# EAGLE design circuit (EAGLE 6.2)
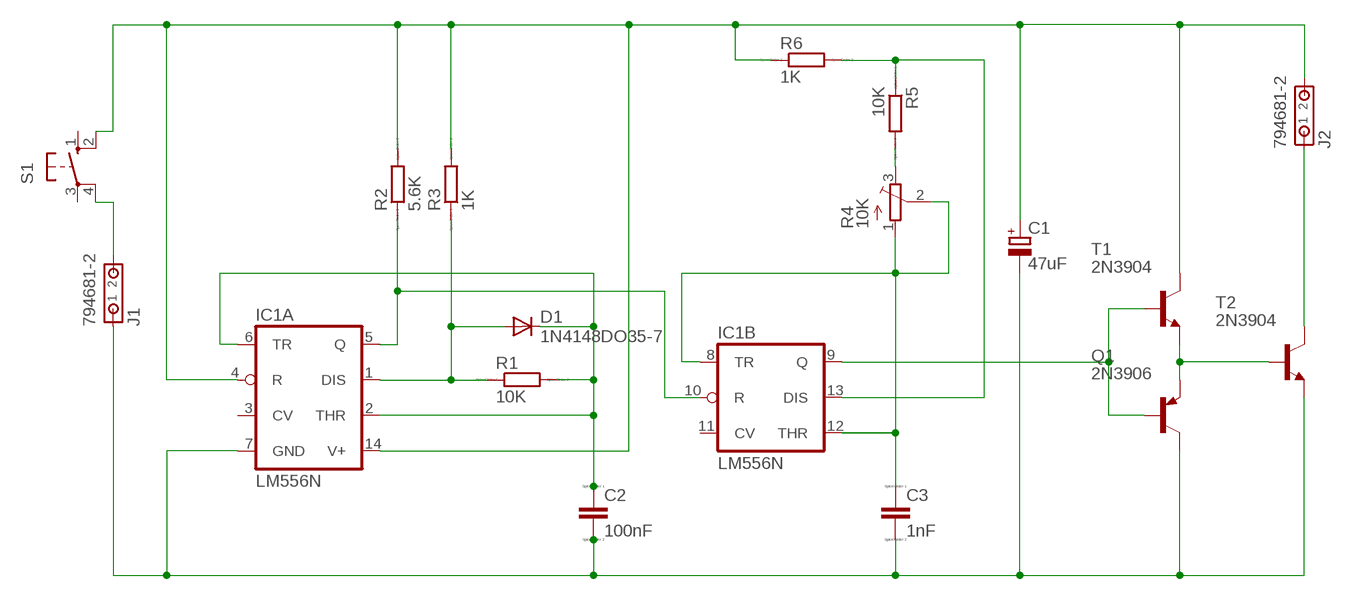
[diagram p0: schematic, sheet 1]

## Parts
C1  47uF  CPOL-EUB45181B  [B45181B]
C2  100nF  C  [C0805]
C3  1nF  C  [C0805]
D1  1N4148DO35-7  [DO35-7]
IC1  LM556N  [DIL14]
J1  794681-2  [794681-2]
J2  794681-2  [794681-2]
Q1  2N3906  [TO92]
R1  10K  R  [R0805]
R2  5.6K  R  [R0805]
R3  1K  R  [R0805]
R4  10K  TRIM_EU-3223J  [3223J]
R5  10K  R  [R0805]
R6  1K  R  [R0805]
S1  10-XX  [B3F-10XX]
T1  2N3904  [TO92]
T2  2N3904  [TO92]

## Nets
N$1: C1.+ IC1.4(A:R) IC1.14(A:V+) J2.2 R2.2 R3.2 R6.1 S1.2(S1) T1.1(C)
N$2: IC1.5(A:Q) IC1.10(B:R) R2.1
N$3: C1.- C2.2 C3.2 IC1.7(A:GND) J1.1 Q1.1(C) T2.3(E)
N$4: C2.1 D1.C IC1.2(A:THR) IC1.6(A:TR) R1.2
N$5: D1.A IC1.1(A:DIS) R1.1 R3.1
N$6: C3.1 IC1.8(B:TR) IC1.12(B:THR) R4.1(A) R4.2(S)
N$7: R4.3(E) R5.2
N$8: IC1.13(B:DIS) R5.1 R6.2
N$10: IC1.9(B:Q) Q1.2(B) T1.2(B)
N$11: Q1.3(E) T1.3(E) T2.2(B)
N$15: J2.1 T2.1(C)
N$20: J1.2 S1.4(P1)
Unconnected: IC1.3(A:CV) IC1.11(B:CV) S1.1(S) S1.3(P)

## Library data of the parts
C1 = rcl:CPOL-EU: POLARIZED CAPACITOR, European symbol
C2 C3 = eagle-ltspice:C: CAPACITOR, European symbol; SPICEMODEL: NONE; SPICEPREFIX: C
D1 = diode:1N4148: DIODE high speed (Philips)
IC1 = linear:*556: Dual TIMER
J1 J2 = con-amp:794681-2: Micro MATE-N-LOK Connectors grid 1.5mm Dual Row Through Hole Vertical Metal Through Hole Holddowns Source: ENG_CD_794681_E.pdf
Q1 = transistor-pnp:2N3906: PNP Transistor
R1-R3 R5 R6 = eagle-ltspice:R: RESISTOR, European symbol; SPICEMODEL: NONE; SPICEPREFIX: R
R4 = pot:TRIM_EU-: POTENTIOMETER
S1 = switch-omron:10-XX: OMRON SWITCH; MPN: B3F-1000; OC_FARNELL: 176432; OC_NEWARK: 36M3542
T1 T2 = transistor-neu-to92:2N3904: NPN TRANSISTOR

## Board
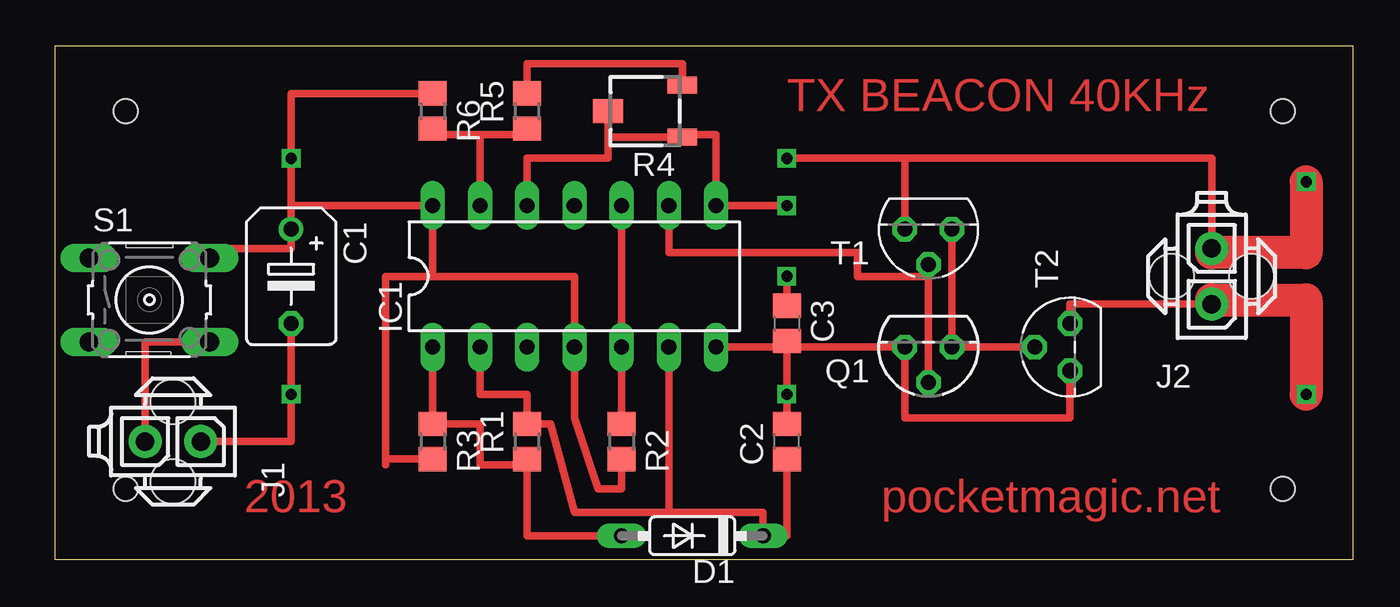
[diagram p1: board, top side]
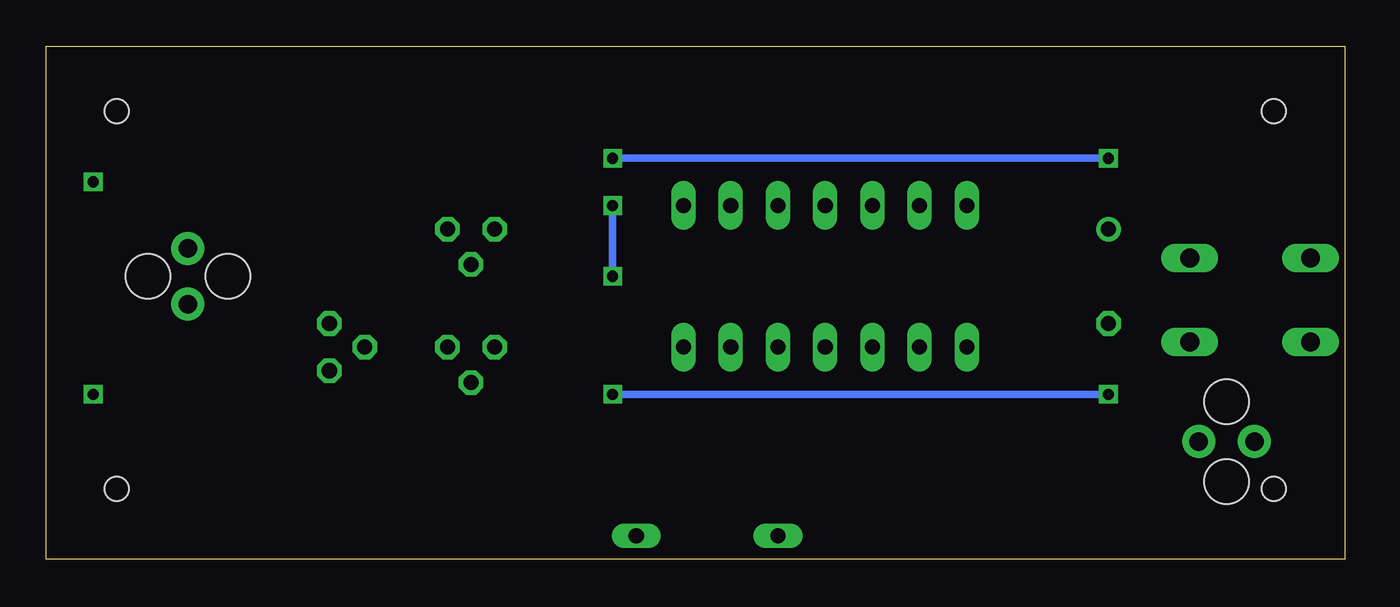
[diagram p2: board, bottom side, seen from below]

Size 69.83 x 27.61 mm. Coordinates in mm from the lower left corner, seen from the top.
Outline: 0,0 69.83,0 69.83,27.61 0,27.61 0,0
Copper layers (1*16): Top 0.035mm / dielectric 1.5mm / Bottom 0.035mm
Design rules: minimum track width 10mil, minimum drill 24mil, track to track 8mil, track to pad 8mil, pad to pad 8mil, via to via 8mil, smd to smd 8mil, copper to edge 40mil, drill to drill 8mil, minimum pad ring 10mil, minimum via ring 8mil, stop-mask expansion 4mil, vias tented up to drill 0mil, thermal gap 10mil
Holes 1.3 mm at 3.81,24.13 3.81,3.81 66.04,3.81 66.04,24.13

### Footprints (pad centres in the part's own frame; a part is rotated, then mirrored left to right if it is on the bottom)
B45181B = drill 0.813: + -2.54,0 | drill 0.813 octagon: - 2.54,0
C0805 = smd 1.3 x 1.5: 1 -0.95,0; 2 0.95,0
DO35-7 = drill 0.813 long: A 3.81,0; C -3.81,0
DIL14 = drill 0.813 long: 1 -7.62,-3.81; 2 -5.08,-3.81; 3 -2.54,-3.81; 4 0,-3.81; 5 2.54,-3.81; 6 5.08,-3.81; 7 7.62,-3.81; 8 7.62,3.81; 9 5.08,3.81; 10 2.54,3.81; 11 0,3.81; 12 -2.54,3.81; 13 -5.08,3.81; 14 -7.62,3.81
794681-2 = drill 1 pad 1.778: 1 0,-1.5; 2 0,1.5 | hole 2.4: 2.13,0; -2.17,0
TO92 = drill 0.813 octagon: 1 1.27,0; 2 0,1.905; 3 -1.27,0
R0805 = smd 1.3 x 1.5: 1 -0.95,0; 2 0.95,0
3223J = smd 1.6 x 0.9: 1 -2,1.4; 3 -2,-1.4 | smd 1.6 x 1.3: 2 2,0
B3F-10XX = drill 1.016 long: 1 -3.251,2.261; 2 3.251,2.261; 3 -3.251,-2.261; 4 3.251,-2.261

### Placement (x,y rotation side)
C1  12.7,15.24 270 top
C2  39.37,6.35 90 top
C3  39.37,12.7 270 top
D1  34.29,1.27 180 top
IC1  27.94,15.24 0 top
J1  6.35,6.35 90 top
J2  62.23,15.24 0 top
Q1  46.99,11.43 180 top
R1  25.4,6.35 90 top
R2  30.48,6.35 270 top
R3  20.32,6.35 270 top
R4  31.75,24.13 180 top
R5  25.4,24.13 90 top
R6  20.32,24.13 270 top
S1  5.08,13.97 0 top
T1  46.99,17.78 180 top
T2  54.61,11.43 90 top

### Tracks (layer width: path | path; a pad name or v marks a point on that pad's centre or on a via)
N$1  (2 unrouted)
  Top 0.406: 12.7,19.05 C1.+ 12.7,16.74 8.33,16.74 S1.2 | 12.7,19.05 12.7,21.59 12.7,25.08 R6.1 | 12.7,19.05 IC1.14 20.32,15.24 | 20.32,15.24 27.94,15.24 IC1.4 27.94,7.62 29.21,3.81 30.48,3.81 R2.2 | 45.72,21.59 T1.1 45.72,21.59 | 45.72,21.59 39.37,21.59 | R3.2 17.78,5.4 17.78,5.08 17.78,15.24 20.32,15.24 | 45.72,21.59 62.23,21.59 J2.2
  Bottom 0.406: 39.37,21.59 12.7,21.59
N$2
  Top 0.406: IC1.10 IC1.5 R2.1
N$3  (2 unrouted)
  Top 0.406: C1.- 12.7,8.89 12.7,6.35 J1.1 | 39.37,11.43 39.37,8.89 C2.2 | 39.37,11.43 C3.2 39.37,11.43 | IC1.7 39.37,11.43 | 39.37,11.43 Q1.1 45.72,7.62 54.61,7.62 T2.3
  Bottom 0.406: 12.7,8.89 39.37,8.89
N$4
  Top 0.406: IC1.2 22.86,8.89 25.4,8.89 R1.2 26.67,7.3 27.94,2.54 33.02,2.54 | C2.1 39.37,1.27 D1.C 38.1,2.54 33.02,2.54 | IC1.6 33.02,2.54
N$5
  Top 0.406: IC1.1 R3.1 22.86,7.3 22.86,5.08 25.4,5.08 R1.1 25.4,1.27 D1.A
N$6  (2 unrouted)
  Top 0.406: IC1.12 25.4,21.59 29.75,21.59 29.75,22.86 | 29.75,22.86 R4.2 | 29.75,22.86 29.75,22.73 R4.1 33.75,22.86 35.56,22.86 IC1.8 39.37,19.05 | C3.1 39.37,15.24
  Bottom 0.406: 39.37,19.05 39.37,15.24
N$7
  Top 0.406: R5.2 25.4,26.67 33.75,26.67 R4.3
N$8
  Top 0.406: 22.86,22.86 IC1.13 22.86,22.86 | 22.86,22.86 20.32,22.86 R6.2 | 22.86,22.86 25.4,22.86 R5.1
N$9  (via drill 0.6)
  other vias: 12.7,21.59
N$10
  Top 0.406: IC1.9 33.02,16.51 43.18,16.51 43.18,15.24 46.99,15.24 T1.2 Q1.2
N$11
  Top 0.406: T1.3 Q1.3 T2.2
N$12  (via drill 0.6)
  other vias: 39.37,21.59
N$13  (via drill 0.6)
  other vias: 12.7,8.89
N$14  (via drill 0.6)
  other vias: 39.37,8.89
N$15
  Top 0.406: J2.1 54.61,13.74 T2.1
N$16  (via drill 0.6)
  other vias: 39.37,15.24
N$17  (via drill 0.6)
  other vias: 39.37,19.05
N$18  (via drill 0.6)
  Top 1.778: 62.23,13.97 67.31,13.97 v67.31,8.89
N$19  (via drill 0.6)
  Top 1.778: v67.31,20.32 67.31,16.51 62.23,16.51
N$20
  Top 0.406: S1.4 4.85,11.71 J1.2

### Text on the board
Top: TX BEACON 40KHz | 2013 | pocketmagic.net